# Altium schematic sheet Top.SchDoc
size A4
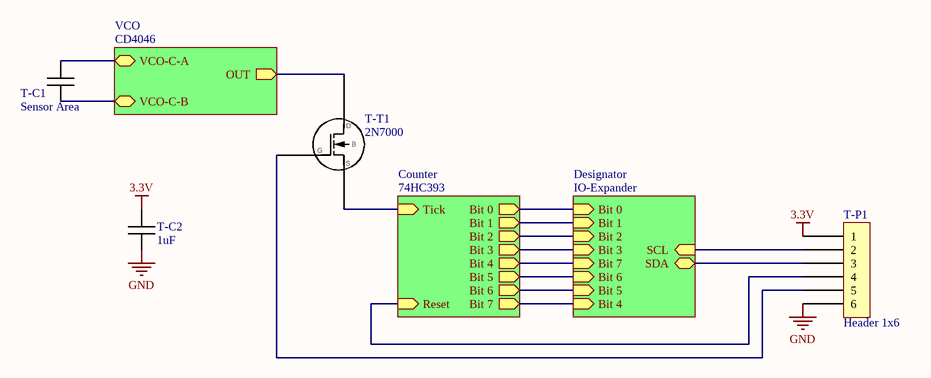
[diagram p0: Top.SchDoc]

## Parts
T-C1  Sensor Area
T-C2  1uF  [C 0805 / 2012]
T-P1  Header 1x6  [Header 1x6]
T-T1  2N7000  [SOT-23-3]

## Sub-sheets
74HC393 = Counter: Tick (in), Reset (in), Bit 0 (out), Bit 1 (out), Bit 2 (out), Bit 3 (out), Bit 4 (out), Bit 5 (out), Bit 6 (out), Bit 7 (out)
CD4046 = VCO: VCO-C-A (bidir), VCO-C-B (bidir), OUT (out)
Designator = IO-Expander: Bit 0 (in), Bit 1 (in), Bit 2 (in), Bit 3 (in), Bit 4 (in), Bit 5 (in), Bit 6 (in), Bit 7 (in), SCL (in), SDA (bidir)

## Nets
3.3V: T-C2.1 T-P1.1
GND: T-C2.2 T-P1.6
NetT-C1_1: T-C1.1 ; sheet CD4046/VCO-C-A
NetT-C1_2: T-C1.2 ; sheet CD4046/VCO-C-B
NetT-P1_2: T-P1.2 ; sheet Designator/SCL
NetT-P1_3: T-P1.3 ; sheet Designator/SDA
NetT-P1_4: T-P1.4 ; sheet 74HC393/Reset
NetT-P1_5: T-P1.5 T-T1.1
NetT-T1_2: T-T1.2 ; sheet 74HC393/Tick
NetT-T1_3: T-T1.3 ; sheet CD4046/OUT
(unnamed): sheet 74HC393/Bit 0, sheet Designator/Bit 0
(unnamed): sheet 74HC393/Bit 1, sheet Designator/Bit 1
(unnamed): sheet 74HC393/Bit 2, sheet Designator/Bit 2
(unnamed): sheet 74HC393/Bit 3, sheet Designator/Bit 3
(unnamed): sheet 74HC393/Bit 4, sheet Designator/Bit 7
(unnamed): sheet 74HC393/Bit 5, sheet Designator/Bit 6
(unnamed): sheet 74HC393/Bit 6, sheet Designator/Bit 5
(unnamed): sheet 74HC393/Bit 7, sheet Designator/Bit 4

## Library data of the parts
T-C1 T-C2 = Capacitor
T-T1 = 2N7000: N-FET